# EAGLE board controller_old (EAGLE 9.0.0)
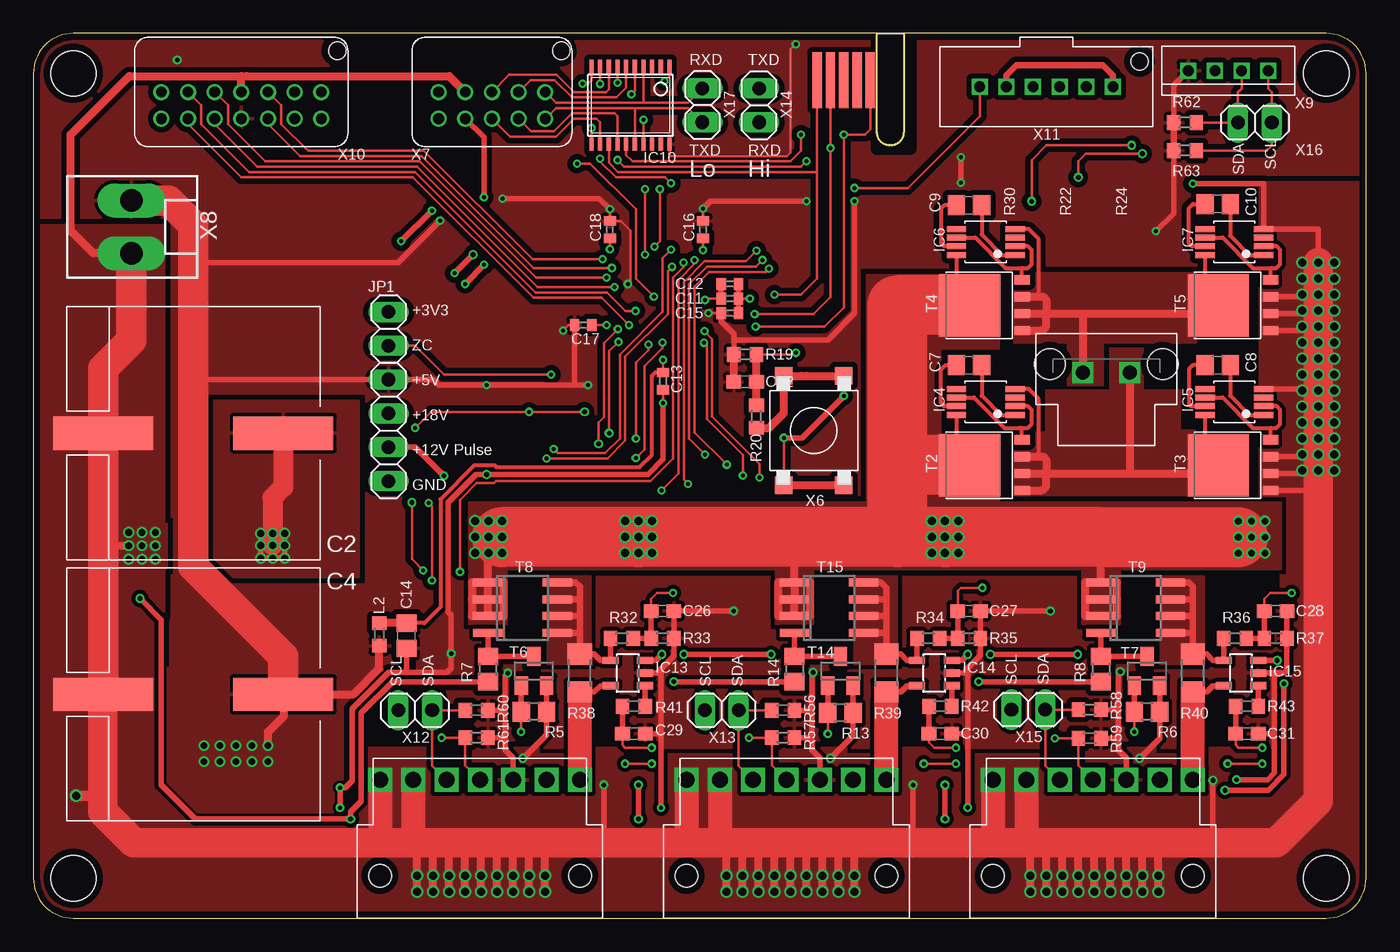
[diagram p6: board, top side]
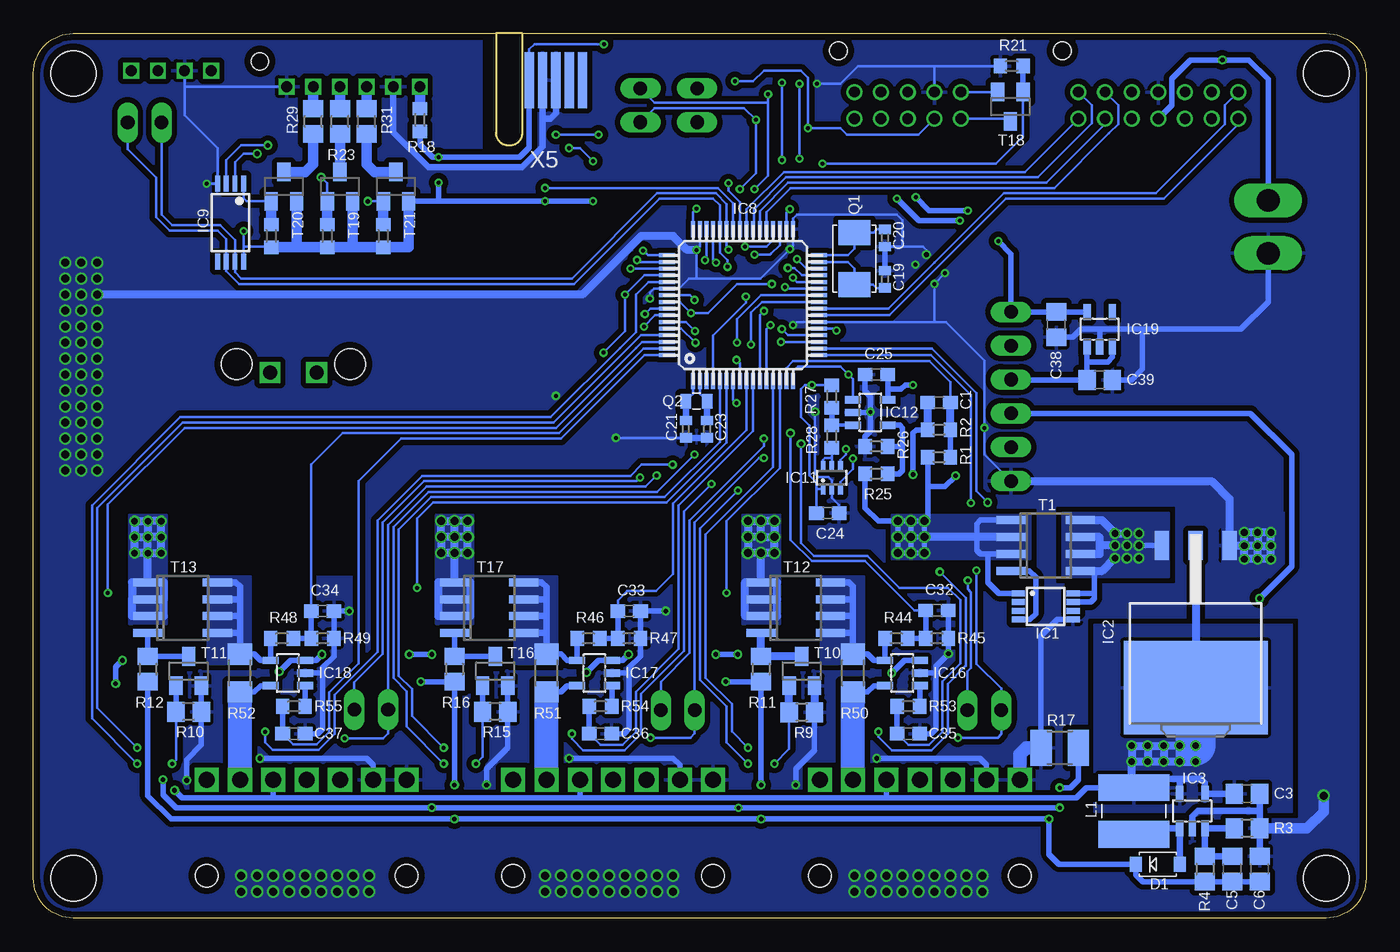
[diagram p7: board, bottom side, seen from below]

Size 100 x 66.4 mm. Coordinates in mm from the lower left corner, seen from the top.
Outline: 0,63.4 0,3 arc90 3,0 97,0 arc90 100,3 100,63.4 arc90 97,66.4 3,66.4 arc90 0,63.4
Copper layers (1*16): Top 0.035mm / dielectric 1.6mm / Bottom 0.035mm
Design rules "Elecrow_2-layer_PCB_eagle_rule *": minimum track width 6mil, minimum drill 0.3mm, track to track 0.2mm, track to pad 0.2mm, pad to pad 6mil, via to via 8mil, smd to smd 0mil, copper to edge 20mil, drill to drill 10mil, minimum pad ring 6mil, minimum via ring 6mil, stop-mask expansion 0mil, vias tented up to drill 100mil, thermal gap 10mil
Net classes: 0 µC: width 0.2 mm, drill 0.3 mm, clearance 0.2 mm; 1 +18V: width 0.4 mm, drill 0.35 mm, clearance 0.3 mm
Holes 3.4 mm at 3,63.4 97,63.4 97,3 3,3

## Footprints (pad centres in the part's own frame; a part is rotated, then mirrored left to right if it is on the bottom)
C0603 = smd 1.1 x 1: 1 -0.85,0; 2 0.85,0
C_EEVFK = smd 7.5 x 2.5: + -6.75,0; - 6.75,0
C0805 = smd 1.3 x 1.5: 1 -0.95,0; 2 0.95,0
C0402 = smd 0.7 x 0.9: 1 -0.65,0; 2 0.65,0
SOD-123 = smd 0.9 x 1.1: 1 -1.635,0; 2 1.635,0
MSOP8 = smd 0.45 x 1: 1 -0.975,-2.05; 2 -0.325,-2.05; 3 0.325,-2.05; 4 0.975,-2.05; 5 0.975,2.05; 6 0.325,2.05; 7 -0.325,2.05; 8 -0.975,2.05
TO263 = smd 1.07 x 2.16: 1 -2.54,-14.17; 2 0,-14.17; 3 2.54,-14.17 | smd 10.8 x 7: 4 0,-3.5
SOT23-5L = smd 0.55 x 1.2: 1 -0.95,-1.3; 2 0,-1.3; 3 0.95,-1.3; 4 0.95,1.3; 5 -0.95,1.3
VSSOP-8 = smd 0.45 x 1.45: 1 -0.975,-2.2; 2 -0.325,-2.2; 3 0.325,-2.2; 4 0.975,-2.2; 5 0.975,2.2; 6 0.325,2.2; 7 -0.325,2.2; 8 -0.975,2.2
TQFP64-10X10 = smd 1.2 x 0.3: 1 -5.7,3.75; 2 -5.7,3.25; 3 -5.7,2.75; 4 -5.7,2.25; 5 -5.7,1.75; 6 -5.7,1.25; 7 -5.7,0.75; 8 -5.7,0.25; 9 -5.7,-0.25; 10 -5.7,-0.75; 11 -5.7,-1.25; 12 -5.7,-1.75; 13 -5.7,-2.25; 14 -5.7,-2.75; 15 -5.7,-3.25; 16 -5.7,-3.75; 33 5.7,-3.75; 34 5.7,-3.25; 35 5.7,-2.75; 36 5.7,-2.25; 37 5.7,-1.75; 38 5.7,-1.25; 39 5.7,-0.75; 40 5.7,-0.25; 41 5.7,0.25; 42 5.7,0.75; 43 5.7,1.25; 44 5.7,1.75; 45 5.7,2.25; 46 5.7,2.75; 47 5.7,3.25; 48 5.7,3.75 | smd 0.3 x 1.2: 17 -3.75,-5.7; 18 -3.25,-5.7; 19 -2.75,-5.7; 20 -2.25,-5.7; 21 -1.75,-5.7; 22 -1.25,-5.7; 23 -0.75,-5.7; 24 -0.25,-5.7; 25 0.25,-5.7; 26 0.75,-5.7; 27 1.25,-5.7; 28 1.75,-5.7; 29 2.25,-5.7; 30 2.75,-5.7; 31 3.25,-5.7; 32 3.75,-5.7; 49 3.75,5.7; 50 3.25,5.7; 51 2.75,5.7; 52 2.25,5.7; 53 1.75,5.7; 54 1.25,5.7; 55 0.75,5.7; 56 0.25,5.7; 57 -0.25,5.7; 58 -0.75,5.7; 59 -1.25,5.7; 60 -1.75,5.7; 61 -2.25,5.7; 62 -2.75,5.7; 63 -3.25,5.7; 64 -3.75,5.7
TSSOP8 = smd 1.2 x 0.35: 1 -2.925,0.975; 2 -2.925,0.325; 3 -2.925,-0.325; 4 -2.925,-0.975; 5 2.925,-0.975; 6 2.925,-0.325; 7 2.925,0.325; 8 2.925,0.975
TSSOP20 = smd 0.305 x 0.991: 1 -2.925,-2.918; 2 -2.275,-2.918; 3 -1.625,-2.918; 4 -0.975,-2.918; 5 -0.325,-2.918; 6 0.325,-2.918; 7 0.975,-2.918; 8 1.625,-2.918; 9 2.275,-2.918; 10 2.925,-2.918; 11 2.925,2.918; 12 2.275,2.918; 13 1.625,2.918; 14 0.975,2.918; 15 0.325,2.918; 16 -0.325,2.918; 17 -0.975,2.918; 18 -1.625,2.918; 19 -2.275,2.918; 20 -2.925,2.918
SC70-6L = smd 0.35 x 0.8: 1 -0.65,-0.85; 2 0,-0.85; 3 0.65,-0.85; 4 0.65,0.85; 5 0,0.85; 6 -0.65,0.85
1X06 = drill 1.016 long: 1 -6.35,0; 2 -3.81,0; 3 -1.27,0; 4 1.27,0; 5 3.81,0; 6 6.35,0
WE-TPC = smd 5.3 x 2: 1 0,1.75; 2 0,-1.75
L0603 = smd 1 x 1.1: 1 -0.85,0; 2 0.85,0
5X3.2 = smd 1.9 x 2.4: 1 -1.95,0; 2 1.95,0
2X1.2 = smd 0.8 x 1.1: 1 -0.8,0; 2 0.8,0
R0603 = smd 1 x 1.1: 1 -0.85,0; 2 0.85,0
R0805 = smd 1.3 x 1.5: 1 -0.95,0; 2 0.95,0
R1210 = smd 1.6 x 2.7: 1 -1.4,0; 2 1.4,0
R1206 = smd 1.6 x 1.803: 1 -1.422,0; 2 1.422,0
SO8 = smd 0.6 x 2.2: 1 -1.905,-2.6; 2 -0.635,-2.6; 3 0.635,-2.6; 4 1.905,-2.6; 5 1.905,2.6; 6 0.635,2.6; 7 -0.635,2.6; 8 -1.905,2.6
LFPAK56-5 = smd 0.7 x 1.15: 1 -1.905,-2.725; 2 -0.635,-2.725; 3 0.635,-2.725; 4 1.905,-2.725 | smd 4.7 x 4.6: 5 0,1.2
SOT23 = smd 1 x 1.4: 1 -0.95,-1.1; 2 0.95,-1.1; 3 0,1.1
ULTRAFIT-2 = drill 1.05 square: 1 -1.75,0; 2 1.753,0 | hole 2.3: -4.25,-0.63; 4.25,-0.63
NANOFIT-7 = drill 1.2 square: 1 7.5,10.37; 2 5,10.37; 3 2.5,10.37; 4 0,10.37; 5 -2.5,10.37; 6 -5,10.37; 7 -7.5,10.37 | hole 1.7: -7.5,3.2; 7.5,3.2
DEBUG-CON = smd 0.7 x 4.2: 1 -2,-3.5; 2 -1,-3.5; 3 0,-3.5; 4 1,-3.5; 5 2,-3.5 | smd 0.7 x 4.2 bottom: 6 -2,-3.5; 7 -1,-3.5; 8 0,-3.5; 9 1,-3.5; 10 2,-3.5
B3S = smd 1.3 x 1.3: 1 4.1,-2.25; 2 -4.1,-2.25; 3 4.1,2.25; 4 -4.1,2.25
I-GRID-10 = drill 0.8: 1 -4,2; 2 -4,0; 3 -2,2; 4 -2,0; 5 0,2; 6 0,0; 7 2,2; 8 2,0; 9 4,2; 10 4,0 | hole 1.3: -5.2,-3.1
KK-156-2 = drill 1.7 pad 2.184 long: 1 -1.98,0; 2 1.98,0
MICRO-LATCH-4 = drill 0.8 square: 1 -3,0; 2 -1,0; 3 1,0; 4 3,0
I-GRID-14 = drill 0.8: 1 -6,2; 2 -6,0; 3 -4,2; 4 -4,0; 5 -2,2; 6 -2,0; 7 0,2; 8 0,0; 9 2,2; 10 2,0; 11 4,2; 12 4,0; 13 6,2; 14 6,0 | hole 1.3: -7.2,-3.1
MICRO-CLASP-6 = drill 0.8 square: 1 -5,0; 2 -3,0; 3 -1,0; 4 1,0; 5 3,0; 6 5,0 | hole 1.3: 7,1.9
1X02 = drill 1.016 long: 1 -1.27,0; 2 1.27,0

## Placement (x,y rotation side)
C1  1nF  [C0603]  32.05,38.7 180 bottom
C2  3300µ  [C_EEVFK]  12,36.4 180 top
C3  2.2µF  [C0805]  8.95,9.35 0 bottom
C4  3300µ  [C_EEVFK]  12,16.8 180 top
C5  150pF  [C0805]  10.05,3.7 90 bottom
C6  4.7µF  [C0805]  8,3.7 90 bottom
C7  680nF 5%  [C0805]  70.2,41.5 0 top
C8  680nF 5%  [C0805]  88.85,41.5 0 top
C9  680nF 5%  [C0805]  70.2,53.5 0 top
C10  680nF 5%  [C0805]  88.85,53.6 0 top
C11  1µF  [C0402]  52.25,46.5 0 top
C12  100nF  [C0402]  52.25,47.6 0 top
C13  100nF  [C0402]  47.25,40.3 270 top
C14  10µF  [C0805]  28,21.2 270 top
C15  100nF  [C0402]  52.25,45.4 0 top
C16  100nF  [C0402]  50.25,51.67 270 top
C17  100nF  [C0402]  41.25,44.5 0 top
C18  100nF  [C0402]  43.25,51.67 270 top
C19  27pF  [C0402]  36.1,47.95 90 bottom
C20  27pF  [C0402]  36.1,51.05 270 bottom
C21  22pF  [C0402]  51.05,36.7 270 bottom
C22  100pF  [C0603]  53.4,40.25 0 top
C23  22pF  [C0402]  49.45,36.7 270 bottom
C24  100nF  [C0603]  40.4,30.4 0 bottom
C25  100nF  [C0603]  36.75,40.8 180 bottom
C26  1nF  [C0603]  47.2,23.05 0 top
C27  1nF  [C0603]  70.2,23.05 0 top
C28  1nF  [C0603]  93.2,23.05 0 top
C29  150nF  [C0603]  45.05,13.85 0 top
C30  150nF  [C0603]  68.05,13.85 0 top
C31  150nF  [C0603]  91.05,13.85 0 top
C32  1nF  [C0603]  32.2,23.1 0 bottom
C33  1nF  [C0603]  55.3,23.05 0 bottom
C34  1nF  [C0603]  78.3,23.05 0 bottom
C35  150nF  [C0603]  34.35,13.85 0 bottom
C36  150nF  [C0603]  57.45,13.85 0 bottom
C37  150nF  [C0603]  80.45,13.85 0 bottom
C38  10µF  [C0805]  23.25,44.55 270 bottom
C39  10µF  [C0805]  20,40.4 0 bottom
D1  MBR05020L  [SOD-123]  15.63,4.05 0 bottom
IC1  LTC4357  [MSOP8]  24.05,23.4 270 bottom
IC2  LM1084  [TO263]  12.8,13.79 180 bottom
IC3  LMR62014  [SOT23-5L]  13.05,8.05 0 bottom
IC4  LM74670  [VSSOP-8]  71.45,38.75 90 top
IC5  LM74670  [VSSOP-8]  90.1,38.75 90 top
IC6  LM74670  [VSSOP-8]  71.45,50.75 90 top
IC7  LM74670  [VSSOP-8]  90.1,50.75 90 top
IC8  ATSAMC21J  [TQFP64-10X10]  46.75,46 90 bottom
IC9  PCA9533  [TSSOP8]  85.2,52.2 270 bottom
IC10  ST2378E  [TSSOP20]  44.8,61 180 top
IC11  5k  [SC70-6L]  40.1,33.05 0 bottom
IC12  LT1803  [SOT23-5L]  37.2,37.95 270 bottom
IC13  INA196  [SOT23-5L]  44.6,18.4 90 top
IC14  INA196  [SOT23-5L]  67.6,18.4 90 top
IC15  INA196  [SOT23-5L]  90.6,18.4 90 top
IC16  INA196  [SOT23-5L]  34.8,18.4 90 bottom
IC17  INA196  [SOT23-5L]  57.9,18.4 90 bottom
IC18  INA196  [SOT23-5L]  80.9,18.4 90 bottom
IC19  [SOT23-5L]  20,44.2 0 bottom
JP1  [1X06]  26.65,39.15 90 top
L1  10µH  [WE-TPC]  17.43,8.05 180 bottom
L2  50R @ 20MHz  [L0603]  25.95,21.3 90 top
Q1  24MHz  [5X3.2]  38.4,49.5 90 bottom
Q2  32768kHz  [2X1.2]  50.25,38.8 0 bottom
R1  665k  [R0603]  32.05,34.6 180 bottom
R2  210k  [R0603]  32.05,36.65 0 bottom
R3  13k3  [R0805]  8.95,6.75 180 bottom
R4  182k  [R0805]  12.1,3.7 270 bottom
R5  4,7k  [R0805]  37.55,15.5 180 top
R6  4,7k  [R0805]  83.55,15.5 180 top
R7  4,7k  [R0805]  34.1,18.7 270 top
R8  4,7k  [R0805]  80.1,18.7 270 top
R9  4,7k  [R0805]  42.35,15.45 180 bottom
R10  4,7k  [R0805]  88.35,15.5 180 bottom
R11  4,7k  [R0805]  45.4,18.7 270 bottom
R12  4,7k  [R0805]  91.4,18.7 270 bottom
R13  4,7k  [R0805]  60.55,15.4 180 top
R14  4,7k  [R0805]  57.1,18.7 270 top
R15  4,7k  [R0805]  65.35,15.5 180 bottom
R16  4,7k  [R0805]  68.4,18.7 270 bottom
R17  0  [R1210]  23,12.8 0 bottom
R18  10k  [R0603]  71,59.9 270 bottom
R19  2k2  [R0603]  53.4,42.3 180 top
R20  330  [R0603]  54.25,37.65 90 top
R21  10k  [R0603]  26.6,63.95 0 bottom
R22  10k  [R0603]  77.95,51.2 270 bottom
R23  294  [R0805]  77,59.8 90 bottom
R24  10k  [R0603]  82.15,51.2 270 bottom
R25  100k 0.1%  [R0603]  36.75,33.35 180 bottom
R26  41k7 0.1%  [R0603]  36.75,35.4 0 bottom
R27  24k 0.1%  [R0603]  40.1,39.15 90 bottom
R28  200 0.1%  [R0603]  40.1,36.15 90 bottom
R29  210  [R0805]  79,59.8 90 bottom
R30  10k  [R0603]  73.75,51.2 270 bottom
R31  210  [R0805]  75,59.8 90 bottom
R32  665k  [R0603]  44.15,21 180 top
R33  210k  [R0603]  47.2,21 180 top
R34  665k  [R0603]  67.15,21 180 top
R35  210k  [R0603]  70.2,21 180 top
R36  665k  [R0603]  90.15,21 180 top
R37  210k  [R0603]  93.2,21 180 top
R38  20m  [R1206]  41,18.4 270 top
R39  20m  [R1206]  64,18.4 270 top
R40  20m  [R1206]  87,18.4 270 top
R41  1k1  [R0603]  45.05,15.9 180 top
R42  1k1  [R0603]  68.05,15.9 180 top
R43  1k1  [R0603]  91.05,15.9 180 top
R44  665k  [R0603]  35.25,21 180 bottom
R45  210k  [R0603]  32.2,21 180 bottom
R46  665k  [R0603]  58.35,21 180 bottom
R47  210k  [R0603]  55.3,21 180 bottom
R48  665k  [R0603]  81.35,21 180 bottom
R49  210k  [R0603]  78.3,21 180 bottom
R50  20m  [R1206]  38.5,18.4 270 bottom
R51  20m  [R1206]  61.5,18.4 270 bottom
R52  20m  [R1206]  84.5,18.4 270 bottom
R53  1k1  [R0603]  34.35,15.9 180 bottom
R54  1k1  [R0603]  57.45,15.9 180 bottom
R55  1k1  [R0603]  80.45,15.9 180 bottom
R56  4.7k  [R0603]  56.25,15.6 0 top
R57  4.7k  [R0603]  56.25,13.55 0 top
R58  4.7k  [R0603]  79.25,15.65 0 top
R59  4.7k  [R0603]  79.25,13.5 0 top
R60  4.7k  [R0603]  33.25,15.6 0 top
R61  4.7k  [R0603]  33.25,13.55 0 top
R62  4.7k  [R0603]  86.4,59.7 180 top
R63  4.7k  [R0603]  86.4,57.6 180 top
T1  FDS6670A  [SO8]  24.05,27.96 270 bottom
T2  PSMN1R0  [LFPAK56-5]  71.45,34 90 top
T3  PSMN1R0  [LFPAK56-5]  90.1,34 90 top
T4  PSMN1R0  [LFPAK56-5]  71.45,46 90 top
T5  PSMN1R0  [LFPAK56-5]  90.1,46 90 top
T6  NVR4003NT3G  [SOT23]  37.55,18.55 0 top
T7  NVR4003NT3G  [SOT23]  83.55,18.55 0 top
T8  IRF9392PBF  [SO8]  36.7,23.3 270 top
T9  IRF9392PBF  [SO8]  82.7,23.3 270 top
T10  NVR4003NT3G  [SOT23]  42.35,18.55 0 bottom
T11  NVR4003NT3G  [SOT23]  88.35,18.55 0 bottom
T12  IRF9392PBF  [SO8]  42.8,23.3 270 bottom
T13  IRF9392PBF  [SO8]  88.8,23.3 270 bottom
T14  NVR4003NT3G  [SOT23]  60.55,18.55 0 top
T15  IRF9392PBF  [SO8]  59.7,23.3 270 top
T16  NVR4003NT3G  [SOT23]  65.35,18.55 0 bottom
T17  IRF9392PBF  [SO8]  65.8,23.3 270 bottom
T18  BSS7728NH6327XTSA1  [SOT23]  26.7,60.9 180 bottom
T19  BSS84PH6433XTMA1  [SOT23]  77,54.9 0 bottom
T20  BSS84PH6433XTMA1  [SOT23]  81.2,54.9 0 bottom
T21  BSS84PH6433XTMA1  [SOT23]  72.8,54.9 0 bottom
X1  ULTRAFIT-20  [ULTRAFIT-2]  80.5,40.95 180 top
X2  NANOFIT-7  [NANOFIT-7]  33.5,0 0 top
X3  NANOFIT-7  [NANOFIT-7]  56.5,0 0 top
X4  NANOFIT-7  [NANOFIT-7]  79.5,0 0 top
X5  JTAG-EDGE-CON  [DEBUG-CON]  60.8,66.4 0 bottom
X6  B3S-1000  [B3S]  58.55,36.6 270 top
X7  IGRID-10  [I-GRID-10]  34.4,62 180 top
X8  [KK-156-2]  7.35,51.88 270 top
X9  MICRO-LATCH-4  [MICRO-LATCH-4]  89.65,63.6 0 top
X10  IGRID-14  [I-GRID-14]  15.6,62 180 top
X11  MICRO-CLASP-6  [MICRO-CLASP-6]  76,62.4 0 top
X12  [1X02]  28.65,15.6 180 top
X13  [1X02]  51.65,15.6 180 top
X14  [1X02]  54.45,61 90 top
X15  [1X02]  74.65,15.65 180 top
X16  [1X02]  91.65,59.7 0 top
X17  [1X02]  50.2,61 270 top

## Tracks (layer width: path | path; a pad name or v marks a point on that pad's centre or on a via)
12V_WAVE
  Bottom 0.2: C1.1 31.2,40.23 32.77,41.8 43,41.8 43.5,41.3 IC8.15
  Bottom 0.4: R1.1 R2.2
  Bottom 0.6: R2.2 C1.1
+3V3  (via drill 0.3)
  Top 0.2: IC10.11 v41.88,59.3 | IC10.1 47.73,63.17 v47.35,62.8
  Top 0.4: v33.8,54.1 33.8,58.6 X7.7 | v29.9,53.1 v27.6,50.8
  Bottom 0.2: X7.7 33.6,58.8 38.95,58.8 39.45,59.3 v41.88,59.3 41.88,63.08 42.4,63.6 45.2,63.6 46,62.8 v47.35,62.8
  Bottom 0.4: v27.6,50.8 26.65,49.85 JP1.6 C38.1 IC19.5 | v33.8,54.1 32.8,53.1 30.79,53.1 30.21,53.1 v29.9,53.1
+5V  (via drill 0.3, 0.35, 0.5)
  Top 0.2: v50.65,45.4 C15.1 | C16.1 v50.25,53.25 | v43.25,53.2 C18.1 44.08,52.33 44.8,51.6 44.8,47.8 v44.6,47.6 | IC10.20 47.73,57.27 47.8,57.2 56.55,57.2 56.8,57.45 56.8,65.19 v57.2,65.59 | v39.75,44.1 40.15,44.5 C17.1
  Top 0.4: IC13.3 46.7,19.35 v47.15,19.8 | IC14.3 69.65,19.35 v70.1,19.8 | IC15.3 v93.32,19.35 | X2.3 36,12.05 35.4,12.65 35.4,13.55 | X4.3 82,12.05 81.4,12.65 81.4,13.5 | X3.3 59,12.05 58.4,12.65 58.4,13.55 | v89.4,9.6 92.65,9.6 93.83,10.78 v93.83,17.6 | 35.4,13.55 35.4,15.6 | R60.2 35.4,15.6 | R61.2 35.4,13.55 | 35.4,15.6 35.4,18.2 v35.6,18.4 | v71.8,19.8 v78.35,19.8 | 12,40.4 12,40.42 JP1.4 30.02,40.42 30.42,40.02 v34.02,40.02 41.58,40.02 v41.6,40 | v69.6,55.2 v69.6,57.1 | R62.2 85.55,62.5 X9.1 | v84.22,51.55 85.55,52.88 R63.2 | 57.15,13.6 R57.2 58.4,13.55 | v48.8,19.8 v55.35,19.8 | v81.55,18.5 81.4,18.35 81.4,15.65 | 81.4,13.5 81.4,15.65 | v58.5,18.45 58.4,18.35 58.4,15.6 | 58.4,13.55 58.4,15.6 | R56.2 58.4,15.6 | R58.2 81.4,15.65 | R59.2 81.4,13.5 | v43.25,53.2 42.45,54 v35.2,54 | v30.5,52.35 27.35,49.2 12,49.2 | v58,53.8 50.8,53.8 v50.25,53.25 | R19.2 52.55,43.4 | C15.1 51.6,44.8 52.55,43.85 52.55,43.4 | 52.55,43.4 59.6,43.4 61.6,45.4 v61.6,53.8 | C17.1 40.6,40.02 39.65,40.02
  Top 0.5: R63.2 R62.2
  Top 0.6: v17.6,12.95 17.6,14 18.8,15.2 18.8,16.75 C4.+ 24.02,16.8 25.95,18.73 L2.1 | C22.1 R19.2
  Top 2.3: C4.+ 18.75,19.65 12,26.4 12,40.4 12,49.2 12,52 10.14,53.86 X8.1
  Bottom 0.2: 41.25,32.2 C24.1 | IC11.1 41.2,32.2 41.25,32.2 | R27.2 v41.6,40 42.1,40 42.4,39.7 42.4,37.6 41.77,36.97 41.77,33.21 41.25,32.68 41.25,32.2 | IC8.56 51.5,46.25 v50.65,45.4 49.4,45.4 47.2,47.6 v44.6,47.6 | v50.25,53.25 50.5,53 IC8.48 | IC8.34 43.5,52.95 v43.25,53.2 | R24.2 82.2,50.4 84.22,50.4 | IC9.8 84.22,50.4 | 84.22,50.4 v84.22,51.55 | v57.2,65.59 62.41,65.59 62.8,65.2 X5.1 | IC8.21 39.9,44.25 v39.75,44.1
  Bottom 0.4: IC12.5 35.9,39.7 | 35.9,39.7 C25.1 | 36,9.05 X2.3 | 36,9.05 59,9.05 | 59,9.05 82,9.05 | X4.3 82,9.05 | v55.35,19.8 55.8,19.35 IC17.3 57.6,19.35 v58.5,18.45 | v78.35,19.8 78.8,19.35 IC18.3 80.7,19.35 v81.55,18.5 | v89.4,9.6 88.85,9.05 82,9.05 | v93.83,17.6 93.83,18.84 v93.32,19.35 | 36,9.05 21.75,9.05 21,9.8 L1.2 | X3.3 59,9.05 | v35.6,18.4 34.65,19.35 IC16.3 | v47.15,19.8 v48.8,19.8 | v70.1,19.8 v71.8,19.8 | v34.02,40.02 34.58,40.02 34.9,39.7 35.9,39.7 | X5.1 62.8,57.81 63.51,57.1 v69.6,57.1 70.05,57.1 71,58.05 R18.2 | X8.1 7.35,60 7.35,62.95 8.8,64.4 v10.8,64.4 13.2,64.4 14.6,63 14.6,61 X10.7 | v30.5,52.35 33.55,52.35 v35.2,54 | T21.2 69.6,53.8 | 69.6,53.8 v61.6,53.8 v58,53.8 | v69.6,55.2 69.6,53.8 | JP1.4 26.63,40.4 C39.1 20.95,41.75 | 20.95,41.75 20.95,42 IC19.1 | IC19.3 19.05,42.1 19.4,41.75 20.95,41.75
  Bottom 0.5: C3.1 IC3.4 12.1,10.15 12.4,10.45 14,10.45 | IC3.5 14,10.45 | 14,10.45 17.6,10.45 17.6,9.8
  Bottom 0.6: IC2.2 IC2.4 | 17.6,9.8 L1.2 17.6,9.96 v17.6,11.74 | v17.6,12.95 17.6,12.9 | 17.6,12.9 v17.6,11.74 | v16.4,12.95 16.45,12.9 17.6,12.9 | v16.4,11.74 v17.6,11.74 | v15.2,11.74 v16.4,11.74 | v16.4,12.95 v15.2,12.95 | v14,12.95 v15.2,12.95 | v14,11.74 v15.2,11.74 | v14,11.74 v14,12.95 | v14,12.95 v12.8,12.95 v12.8,11.74 v14,11.74 | v16.4,12.95 v16.4,11.74 | v15.2,12.95 v15.2,11.74
  Bottom 0.8: 76.05,50.35 T19.2 | 76.05,50.35 R22.2 80.25,50.35 | R24.2 80.25,50.35 | T20.2 80.25,50.35 | 76.05,50.35 R30.2 71.85,50.35 T21.2
  Bottom 3: v12.8,12.95 IC2.4
  pour Bottom (isolate 0.305): 5.6,22 20.4,22 20.4,8 5.6,8
  pour Top: 9.6,18.8 23.2,18.8 23.2,7.6 12.4,7.6 9.6,10.4
  pour Top (isolate 0.4, rank 4): 0,0 100,0 100,66.4 0,66.4
+12V_PULSE  (via drill 0.35, 0.5, 0.6)
  Top 0.3: IC6.8 69.25,47 T4.5 | IC4.8 69.25,35 T2.5
  Top 0.4: v30.8,33.2 28.66,35.34 JP1.2
  Top 0.6: T15.3 58.3,22.66 58.3,23.93 | 58.3,23.93 T15.2 | 58.3,23.93 58.3,25.2 57.2,25.2 | T15.1 55.9,25.2 55.9,23.93 | T15.2 55.9,23.93 | T15.3 55.9,22.66 55.9,23.93 | T9.1 81.3,25.2 81.3,23.93 | 81.3,23.93 T9.2 78.9,23.93 | 81.3,23.93 81.3,22.66 T9.3 78.9,22.66 78.9,23.93 | T9.1 78.9,25.2 78.9,23.93 | T8.1 35.3,25.2 35.3,23.93 | T8.1 32.9,25.2 32.9,23.93 | 32.9,23.93 T8.2 | 32.9,23.93 32.9,22.66 T8.3 | T8.2 35.3,23.93 | T8.3 35.3,22.66 35.3,23.93 | T8.2 T8.1 | T8.3 T8.2 | T9.1 80.1,28.6 | v34.15,28.6 34.1,28.6 T8.1 | T15.1 57.1,28.6 | T15.1 T15.2 | T15.3 T15.2
  Top 4.5: 64.8,28.6 v68.4,28.6 80.1,28.6 v90.4,28.6 | 64.8,28.6 57.1,28.6 v45.4,28.6 v35.15,28.6 | T2.5 64.8,34 | 64.8,34 64.8,28.6 | T4.5 64.8,46 64.8,34
  Bottom 0.4: T1.3 28.4,27.33 | 28.4,27.33 28.93,27.33 29.2,27.6 29.2,28.6 29.2,29.6 28.93,29.87 T1.1 | 28.4,27.33 28.4,25.2 27.57,24.38 IC1.1 | v33.15,29.8 32.9,30.05 32.9,32.4 | 32.9,32.4 R1.2 | v33.15,29.8 v34.15,29.8 | v34.15,29.8 v35.15,29.8 | 33.2,28.6 v33.15,28.6 v33.15,29.8 | 33.2,28.6 v34.15,28.6 | v34.15,28.6 v35.15,28.6 | 33.2,28.6 33.15,28.55 v33.15,27.4 v34.15,27.4 | v35.15,28.6 v35.15,27.4 v34.15,27.4 | v35.15,28.6 v35.15,29.8 | v34.15,28.6 v34.15,29.8 | v34.15,27.4 34.15,28.35 | 32.9,32.4 31.6,32.4 v30.8,33.2 | R25.2 37.6,30.8 36.6,29.8 v35.15,29.8
  Bottom 0.6: T17.1 69.6,25.2 69.6,23.93 | 69.6,23.93 T17.2 67.2,23.93 | 69.6,23.93 69.6,22.66 T17.3 67.2,22.66 67.2,23.93 | T17.1 67.2,25.2 67.2,23.93 | 92.6,23.93 92.6,22.66 T13.3 90.2,22.66 90.2,23.93 | 92.6,23.93 T13.2 90.2,23.93 | 92.6,23.93 92.6,25.2 T13.1 | 90.2,23.93 90.2,25.2 T13.1 | 46.6,22.66 46.6,23.93 | 46.6,23.93 T12.2 44.2,23.93 | 46.6,23.93 46.6,25.2 T12.1 | T12.3 44.2,22.66 44.2,23.93 | 44.2,23.93 44.2,25.2 T12.1 | T13.1 v91.4,27.4 | T17.1 v68.4,27.4 | v68.4,27.4 v67.4,27.4 67.4,28.5 67.3,28.6 v67.4,28.6 | v68.4,27.4 v69.4,27.4 v69.4,28.6 | v68.4,28.6 v69.4,28.6 | v67.4,28.6 v68.4,28.6 | v67.4,28.6 v67.4,29.8 v68.4,29.8 | v68.4,28.6 v68.4,29.8 | v68.4,27.4 v68.4,28.6 | v68.4,29.8 v69.4,29.8 v69.4,28.6 | v91.4,29.8 v90.4,29.8 v90.4,28.6 | v91.4,29.8 v92.4,29.8 92.4,28.7 92.3,28.6 | 92.3,28.6 v92.4,28.6 v92.4,27.4 v91.4,27.4 | 92.3,28.6 91.5,28.6 | 91.5,28.6 v91.4,28.6 | v90.4,28.6 v91.4,28.6 | v91.4,27.4 v90.4,27.4 v90.4,28.6 | v91.4,27.4 91.4,28.5 91.5,28.6 | v91.4,29.8 v91.4,28.6 | T12.1 v45.4,27.4 | v45.4,27.4 v46.4,27.4 v46.4,28.6 | v46.4,28.6 v46.4,29.8 v45.4,29.8 | v45.4,28.6 v46.4,28.6 | v45.4,28.6 v45.4,29.8 | v45.4,28.6 v44.4,28.6 | v44.4,28.6 v44.4,29.8 v45.4,29.8 | v45.4,27.4 v44.4,27.4 v44.4,28.6 | T1.2 29.2,28.6 v33.15,28.6
  pour Bottom (isolate 0.305, no thermals): 90,22.1 92.8,22.1 92.8,30.25 90,30.25
  pour Bottom (isolate 0.305, no thermals): 67,22.1 69.8,22.1 69.8,30.25 67,30.25
  pour Bottom (isolate 0.305, no thermals): 44,22.1 46.8,22.1 46.8,30.25 44,30.25
  pour Bottom (isolate 0.305, no thermals): 25.2,30.25 35.6,30.25 35.6,26.95 25.2,26.95
  pour Top (isolate 0.305, no thermals): 32.7,31.2 62.55,31.2 62.55,48.25 72.45,48.25 72.45,42.75 68.05,42.75 68.05,36.25 72.45,36.25 72.45,31.2 93.6,31.2 93.6,26.2 81.5,26.2 81.5,22.1 78.7,22.1 78.7,26.2 58.5,26.2 58.5,22.1 55.7,22.1 55.7,26.2 35.5,26.2 35.5,22.1 32.7,22.1
+18V  (via drill 0.35)
  Top 0.4: v48.05,17.75 R14.2 | v45.4,10 v45.4,7.45 | v68.4,7.45 v68.4,10 | R7.2 26.95,17.75 24.6,15.4 24.6,8.77 23.8,7.96 v23.8,7.45 12.15,7.45 9.6,10 9.6,22.4 v8,24 | v70.93,17.75 R8.2
  Bottom 0.4: C6.1 C5.1 R4.2 16.75,2.75 17.27,3.27 D1.1 23.05,4.05 23.8,4.8 v23.8,7.45 v45.4,7.45 v68.4,7.45 89.64,7.45 91.4,9.2 R12.2 | v48.05,17.75 R11.2 v45.4,10 | v68.4,10 R16.2 v70.93,17.75 | v8,24 5.6,26.4 5.6,34.8 8.68,37.88 JP1.3
AC_IN_+
  Top 0.3: IC5.8 87.9,33.37 | IC4.4 74.67,39.73 75.41,38.99 75.41,34.64 75.4,34.63
  Top 0.6: T2.2 76,33.37 | 76,33.37 82.25,33.37 | 82.25,33.37 87.9,33.37 88.9,33.37 T3.5 | T2.3 75.4,34.63 75.77,34.63 76,34.4 76,33.37 | T2.1 75.69,32.09 76,32.4 76,33.37 | X1.1 82.25,33.37
  pour Top (isolate 0.406, no thermals): 73.45,31.75 87.1,31.75 87.1,36.6 86,36.6 86,39.6 83.25,39.6 83.25,42.75 80.8,42.75 80.8,39.6 76,39.6 76,36.45 73.45,36.45
AC_IN_-
  Top 0.3: IC7.8 87.9,45.37 | IC6.4 74.67,51.73 75.41,50.99 75.41,46.64 75.4,46.63
  Top 0.6: T4.2 76,45.37 | 76,45.37 78.75,45.37 | 78.75,45.37 X1.2 | 78.75,45.37 87.9,45.37 88.9,45.37 T5.5 | T4.3 75.4,46.63 75.77,46.63 76,46.4 76,45.37 | T4.1 75.69,44.09 76,44.4 76,45.37
  pour Top (isolate 0.406, no thermals): 73.6,48.4 87.2,48.4 87.2,43.2 80.25,43.2 80.25,40 77.6,40 77.6,43.2 73.6,43.2
AGND  (via drill 0.3, 0.35)
  Top 0.2: v47.25,38.65 C13.2
  Top 0.4: C28.2 R37.1 94.05,18.6 93.85,18.4 93.1,18.4 | 47.1,18.4 47.1,18.72 48.05,19.67 R33.1 C26.2 48.8,23.05 v52.55,23.05 | IC13.2 47.1,18.4 | 70.1,18.4 70.1,18.77 71.05,19.72 R35.1 C27.2 v76.3,23.05 | IC14.2 70.1,18.4 | IC15.2 93.1,18.4 | 93.1,13.85 93.1,10.9 92.6,10.4 v90.27,10.4 | 93.1,13.85 93.1,18.4 | C31.2 93.1,13.85 | 70.1,18.4 70.1,13.85 | 70.1,13.85 v70.1,8.3 | v47.1,8.3 47.1,13.85 | 47.1,13.85 47.1,18.4 | C29.2 47.1,13.85 | 28,18.45 26.66,18.45 23.9,15.69 23.9,10.3 23.4,9.8 v23,9.8 v23,8.3 | C30.2 70.1,13.85 | C14.2 28,18.45 | 28,18.45 31.05,18.45 31.35,18.75 v31.35,19.85 31.35,22.75 31.1,23 31.1,31.2 33.2,33.3 v34,33.3 46.1,33.3 47.25,34.45 v47.25,38.65
  Bottom 0.2: IC8.7 47.5,38.9 v47.25,38.65
  Bottom 0.4: C32.2 R45.1 v31.35,19.85 32.3,18.9 32.3,18.4 | C36.2 55.65,13.85 55.3,14.2 55.3,18.4 | C37.2 78.65,13.85 78.3,14.2 78.3,18.4 | 32.3,18.4 32.3,14.2 32.65,13.85 C35.2 | 78.3,18.4 78.3,18.81 77.45,19.66 R49.1 C34.2 v76.3,23.05 | IC18.2 78.3,18.4 | 55.3,18.4 55.3,18.81 54.45,19.66 R47.1 C33.2 v52.55,23.05 | IC17.2 55.3,18.4 | IC16.2 32.3,18.4 | v23,8.3 38.45,8.3 v47.1,8.3 v70.1,8.3 89.3,8.3 90.27,9.27 v90.27,10.4 | v23,9.8 22.2,9.8 21.6,10.4 R17.2 | R2.1 33.75,36.65 34,36.4 v34,33.3
  Bottom 0.6: R2.1 C1.2
  pour Bottom (isolate 0.305, rank 2): 28.8,25.6 93.6,25.6 93.6,21.2 93.6,12.8 28.8,12.8
  pour Top (isolate 0.305, rank 2): 28.8,25.6 93.6,25.6 93.6,24.8 93.6,12.8 28.8,12.8
BOOST_FB
  Bottom 0.5: C5.2 R4.1 IC3.3 R3.2
BOOST_SW
  Bottom 0.5: D1.2 14,5.6 IC3.1 17.43,6.75 L1.1
CON0_HEATER_0
  Top 0.4: IC13.5 42.55,17.45 42.08,16.98 R38.2
  Top 1: 41,16.4 R38.2
  Top 1.8: X2.1 41,16.4
CON0_HEATER_0_CUR  (via drill 0.3)
  Top 0.2: v46.4,12.8 44.4,12.8 44.2,13 C29.1
  Top 0.4: C29.1 R41.2
  Bottom 0.2: v46.4,12.8 47.6,14 47.6,16.07 49.58,18.05 49.58,28.79 44.5,33.87 IC8.13
CON0_HEATER_0_IN
  Top 0.4: R38.1 42.08,19.82 42.55,19.35 IC13.4 R32.2
  Top 0.5: R38.1 41,21.39 | 41,21.39 T8.5 | 41,21.39 41,22.66 | 41,22.66 T8.6 | 41,22.66 41,23.93 | 41,23.93 T8.7 | T8.8 40.7,25.2 41,24.9 41,23.93
  pour Top (isolate 0.305, no thermals): 38.6,25.65 41.8,25.65 41.8,19.1 38.6,19.1
CON0_HEATER_0_VOL  (via drill 0.3)
  Top 0.2: C26.1 46.35,23.95 46.8,24.4 v48,24.4
  Top 0.4: R32.1 R33.2 C26.1
  Bottom 0.2: v48,24.4 48,29.8 44,33.8 IC8.14
CON0_HEATER_1
  Bottom 0.4: IC16.5 36.8,17.45 36.95,17.45 37.42,16.98 R50.2
  Bottom 1: 38.5,16.3 R50.2
  Bottom 1.8: X2.2 38.5,16.3
CON0_HEATER_1_CUR  (via drill 0.3, 0.35)
  Top 0.2: v42.4,35.6 42.4,37.2 42.8,37.6 42.8,43.15 v43.85,44.2
  Bottom 0.2: C35.1 34.35,13 32.79,13 31.8,13.99 31.8,17.77 30.45,19.12 30.45,23.88 31.37,24.8 35.03,24.8 37.43,27.2 41.43,27.2 42.4,28.17 v42.4,35.6 | v43.85,44.2 43.4,43.75 IC8.20
  Bottom 0.4: R53.2 C35.1
CON0_HEATER_1_IN
  Bottom 0.4: R50.1 37.42,19.82 36.95,19.35 IC16.4 R44.2
  Bottom 0.5: T12.8 38.8,25.2 38.5,24.9 38.5,23.93 | R50.1 38.5,21.39 | 38.5,21.39 T12.5 | 38.5,21.39 38.5,22.66 | 38.5,22.66 T12.6 | 38.5,22.66 38.5,23.93 | 38.5,23.93 T12.7
  pour Bottom (isolate 0.305, no thermals): 40.9,25.65 40.9,19.1 37.7,19.1 37.7,25.65
CON0_HEATER_1_VOL  (via drill 0.3, 0.35)
  Top 0.2: v43.2,36.4 43.2,42.55 v43.9,43.25
  Bottom 0.2: C32.1 33.9,23.1 37.6,26.8 41.6,26.8 43.2,28.4 v43.2,36.4 | v43.9,43.25 IC8.19
  Bottom 0.4: R44.1 R45.2 C32.1
CON0_SCL  (via drill 0.3, 0.35)
  Top 0.2: v30.65,13.55 R61.1 32.4,11.47 X2.4 | v29.25,26.1 28.4,26.95 v28.4,31.2
  Bottom 0.2: v30.65,13.55 27.65,13.55 27.38,13.82 X12.2 27.38,17.23 29.25,19.1 v29.25,26.1 | IC8.18 32.58,42.75 29.25,39.42 29.25,32.05 v28.4,31.2
CON0_SDA  (via drill 0.3)
  Top 0.2: X2.5 29.92,11.45 X12.1 R60.1 | v29.9,25.35 29.9,30.9 v29.65,31.15
  Bottom 0.2: 29.65,19.18 29.65,19.2 | X12.1 29.92,18.51 29.65,18.78 29.65,19.2 | 29.65,19.2 29.65,24.44 29.9,24.69 v29.9,25.35 | IC8.17 38.8,42.25 32.65,42.25 29.65,39.25 v29.65,31.15
CON1_HEATER_0
  Top 0.4: IC14.5 65.55,17.45 65.08,16.98 R39.2
  Top 1: 64,16.3 R39.2
  Top 1.8: X3.1 64,16.3
CON1_HEATER_0_CUR  (via drill 0.3)
  Top 0.2: C30.1 67.2,13.2 67.6,12.8 v69.2,12.8
  Top 0.4: C30.1 R42.2
  Bottom 0.2: v69.2,12.8 71.6,15.2 71.6,17.2 72.58,18.18 72.58,29.19 70.17,31.6 52.65,31.6 48.5,35.75 IC8.5
CON1_HEATER_0_IN
  Top 0.4: R34.2 IC14.4 65.55,19.35 65.08,19.82 R39.1
  Top 0.5: R39.1 64,21.39 | 64,21.39 T15.5 | 64,21.39 64,22.66 | 64,22.66 T15.6 | 64,22.66 64,23.93 | 64,23.93 T15.7 | T15.8 63.59,25.2 64,24.8 64,23.93
  pour Top (isolate 0.305, no thermals): 61.6,25.65 64.8,25.65 64.8,19.1 61.6,19.1
CON1_HEATER_0_VOL  (via drill 0.3)
  Top 0.2: C27.1 69.35,24.55 69.6,24.8 v71.2,24.8
  Top 0.4: R34.1 R35.2 C27.1
  Bottom 0.2: v71.2,24.8 71.2,30 70,31.2 52.48,31.2 48,35.68 IC8.6
CON1_HEATER_1
  Bottom 0.4: R51.2 60.42,16.98 59.95,17.45 IC17.5
  Bottom 1: 61.5,16.15 R51.2
  Bottom 1.8: X3.2 61.5,16.15
CON1_HEATER_1_CUR
  Bottom 0.2: C36.1 57.45,13 55.79,13 54.8,13.99 54.8,17 51.58,20.22 51.58,30.97 46,36.55 IC8.10
  Bottom 0.4: C36.1 R54.2
CON1_HEATER_1_IN
  Bottom 0.4: R51.1 60.42,19.82 59.95,19.35 IC17.4 R46.2
  Bottom 0.5: R51.1 61.5,21.39 | 61.5,21.39 T17.5 | 61.5,21.39 61.5,22.66 | 61.5,22.66 T17.6 | 61.5,22.66 61.5,23.93 | 61.5,23.93 T17.7 | T17.8 61.85,25.2 61.5,24.85 61.5,23.93
  pour Bottom (isolate 0.305, no thermals): 63.9,25.65 63.9,19.1 60.7,19.1 60.7,25.65
CON1_HEATER_1_VOL
  Bottom 0.2: C33.1 56.15,23.85 55.45,24.55 53.3,24.55 52,25.85 52,31.12 46.5,36.62 IC8.9
  Bottom 0.4: R46.1 R47.2 C33.1
CON1_SCL  (via drill 0.3)
  Top 0.2: v53.7,13.55 R57.1 55.4,11.47 X3.4 | v45.2,34.53 45.85,35.18 45.85,41.45 47.2,42.8 v47.2,43.2
  Bottom 0.2: v53.7,13.55 50.7,13.55 50.38,13.87 X13.2 50.38,29.69 45.54,34.53 v45.2,34.53 | IC8.26 45.42,46.75 47.2,44.97 v47.2,43.2
CON1_SDA  (via drill 0.3)
  Top 0.2: R56.1 X13.1 52.92,11.45 X3.5 | v45.2,36 45.2,41.69 46.16,42.64 v46.16,43.04
  Bottom 0.2: X13.1 52.92,17.75 50.78,19.89 50.78,29.86 45.2,35.44 v45.2,36 | v46.16,43.04 46.16,45.44 45.35,46.25 IC8.25
CON2_HEATER_0
  Top 0.4: IC15.5 88.5,17.45 88.03,16.98 R40.2
  Top 1: 87,16.4 R40.2
  Top 1.8: X4.1 87,16.4
CON2_HEATER_0_CUR  (via drill 0.3)
  Top 0.2: C31.1 90.2,13 90.4,12.8 v92.2,12.8
  Top 0.4: R43.2 C31.1
  Bottom 0.2: v92.2,12.8 95.2,15.8 95.2,30.8 88.8,37.2 60.97,37.2 54.42,43.75 IC8.61
CON2_HEATER_0_IN
  Top 0.4: R36.2 IC15.4 88.5,19.35 88.03,19.82 R40.1
  Top 0.5: R40.1 87,21.39 | 87,21.39 T9.5 | 87,21.39 87,22.66 | 87,22.66 T9.6 | 87,22.66 87,23.93 | 87,23.93 T9.7 | T9.8 86.69,25.2 87,24.9 87,23.93
  pour Top (isolate 0.305, no thermals): 84.6,25.65 87.8,25.65 87.8,19.1 84.6,19.1
CON2_HEATER_0_VOL  (via drill 0.3)
  Top 0.2: 92.2,23.2 C28.1 92.35,23.95 92.8,24.4 v94.4,24.4
  Top 0.4: C28.1 R37.2 R36.1
  Bottom 0.2: v94.4,24.4 94.4,31.03 88.63,36.8 60.8,36.8 54.8,42.8 54.35,43.25 IC8.62
CON2_HEATER_1
  Bottom 0.4: IC18.5 82.95,17.45 83.42,16.98 R52.2
  Bottom 1: 84.5,16.45 R52.2
  Bottom 1.8: X4.2 84.5,16.45
CON2_HEATER_1_CUR
  Bottom 0.2: C37.1 80.5,13.05 78.74,13.05 77.8,13.99 77.8,16.93 75.6,19.13 75.6,32.8 72.4,36 60.4,36 54.15,42.25 IC8.64
  Bottom 0.4: C37.1 R55.2
CON2_HEATER_1_IN
  Bottom 0.4: R48.2 IC18.4 82.95,19.35 83.42,19.82 R52.1
  Bottom 0.5: R52.1 84.5,21.39 | 84.5,21.39 T13.5 | 84.5,21.39 84.5,22.66 | 84.5,22.66 T13.6 | 84.5,22.66 84.5,23.93 | 84.5,23.93 T13.7 | T13.8 84.81,25.2 84.5,24.9 84.5,23.93
  pour Bottom (isolate 0.305, no thermals): 86.9,25.65 86.9,19.1 83.7,19.1 83.7,25.65
CON2_HEATER_1_VOL
  Bottom 0.2: C34.1 79.15,34.05 76.8,36.4 60.57,36.4 54.22,42.75 IC8.63
  Bottom 0.4: R48.1 R49.2 C34.1
CON2_SCL  (via drill 0.3)
  Top 0.2: v76.65,13.5 R59.1 78.4,11.47 X4.4 | v53.23,33.23 53.23,34.77 50.53,37.47 50.53,42.97 v50.32,43.18
  Bottom 0.2: v76.65,13.5 73.75,13.5 73.38,13.87 X15.2 73.38,29.52 70.5,32.4 54.05,32.4 v53.23,33.23 | v50.32,43.18 51.4,44.25 IC8.60
CON2_SDA  (via drill 0.3)
  Top 0.2: X4.5 75.92,11.45 X15.1 R58.1 | v54.47,33.07 54.47,34.09 50.93,37.64 50.93,43.47 v50.35,44.05
  Bottom 0.2: X15.1 75.92,17.68 73.78,19.82 73.78,29.68 70.66,32.8 54.75,32.8 v54.47,33.07 | v50.35,44.05 51.05,44.75 IC8.59
DIODE_G
  Bottom 0.4: T1.4 25.26,26.06 24.8,25.6 24.8,22.85 25.23,22.43 IC1.4
GND  (via drill 0.3, 0.35, 0.5, 0.6)
  Top 0.2: C11.2 v53.75,46.5 | C17.2 v43,44.5 | v50.25,50.15 C16.2 | v43.25,50.2 C18.2 | v28.65,36.8 29.85,38 v37.2,38 v41.35,38 | v41.2,62.63 41.63,62.63 41.88,62.88 IC10.10 | X6.1 v56.3,36.05
  Top 0.4: T6.2 R5.1 38.5,13.77 v36.73,12 | T14.2 R13.1 61.5,13.7 v59.8,12 | T7.2 R6.1 84.5,13.5 v83,12 | v88.5,10.35 88.5,5.65 88.03,5.65 | v66,10 66,5.66 64.4,5.66 | v42.8,10 42.8,5.66 | C15.2 C11.2 C12.2 | v56.3,36.05 57.65,36.05 v60.8,39.2 | v96.4,49.2 96.4,51.73 IC7.4 92.3,55.12 v87,55.12 | T5.2 96.4,45.37 v96.4,44.4 | T5.3 96.4,46.63 v96.4,45.6 | T5.1 96.4,44.09 v96.4,43.2 | IC5.4 95.2,39.73 v95.2,39.6 | T3.3 96.4,34.63 v96.4,34.8 | T3.2 96.4,33.37 v96.4,33.6 | T3.1 96.4,32.09 96.4,32.4
  Top 0.5: X11.6 81,63.25 80.25,64 73.75,64 73,63.25 X11.2 | v31.6,48.4 v32.99,49.79 | v33.83,49.03 v32.4,47.6
  Top 0.6: X6.1 X6.3 | v7.15,27.95 5.25,27.95 | X8.2 4.5,49.9 2.8,51.6 2.8,58.8 7.2,63.2 31.2,63.2 X7.8 | X10.8 15.6,63.2 16,63.2 | v28.8,2 v28.8,3.2 28.8,5.66 28.5,5.66 | v30,2 v30,3.2 30,5.66 29.6,5.66 | v31.2,2 v31.2,3.2 31.2,5.66 30.8,5.66 | v32.4,2 v32.4,3.2 32.4,5.66 33.6,5.66 v33.6,3.2 v33.6,2 | v34.8,2 v34.8,3.2 34.8,5.66 | v36,2 v36,3.2 36,5.66 36.4,5.66 | v37.2,2 v37.2,3.2 37.2,5.66 37.6,5.66 | v38.4,2 v38.4,3.2 38.4,5.66 38.8,5.66 | 55.6,5.66 56,5.66 | v52,2 v52,3.2 52,5.66 51.5,5.66 | v53.2,2 v53.2,3.2 53.2,5.66 | v54.4,2 v54.4,3.2 54.4,5.66 55.6,5.66 | v55.6,2 v55.6,3.2 55.6,5.66 | v56.8,2 v56.8,3.2 56.8,5.66 57.2,5.66 58,5.66 v58,3.2 v58,2 | v59.2,2 v59.2,3.2 59.2,5.66 | v60.4,2 v60.4,3.2 60.4,5.66 | v61.6,2 v61.6,3.2 61.6,5.66 | v74.8,2 v74.8,3.2 74.8,5.66 74.55,5.66 | v76,2 v76,3.2 76,5.66 76.4,5.66 | v77.2,2 v77.2,3.2 77.2,5.66 77.6,5.66 | v78.4,2 v78.4,3.2 78.4,5.66 78.8,5.66 | v79.6,2 v79.6,3.2 79.6,5.66 | v80.8,2 v80.8,3.2 80.8,5.66 | v82,2 v82,3.2 82,5.66 | v83.2,2 v83.2,3.2 83.2,5.66 | v84.4,2 v84.4,3.2 84.4,5.66 | v95.2,33.6 v96.4,33.6 v97.6,33.6 | v95.2,34.8 v96.4,34.8 v97.6,34.8 | v95.2,36 v96.4,36 v97.6,36 | v95.2,37.2 v96.4,37.2 v97.6,37.2 | v95.2,38.4 v96.4,38.4 v97.6,38.4 | v95.2,39.6 v96.4,39.6 v97.6,39.6 | v95.2,40.8 v96.4,40.8 v97.6,40.8 | v95.2,42 v96.4,42 v97.6,42 | v95.2,43.2 v96.4,43.2 v97.6,43.2 | v95.2,44.4 v96.4,44.4 v97.6,44.4 | v95.2,45.6 v96.4,45.6 v97.6,45.6 | v95.2,46.8 v96.4,46.8 v97.6,46.8 | v95.2,48 v96.4,48 v97.6,48 | v97.6,49.2 v96.4,49.2 v95.2,49.2
  Top 0.8: 5.2,9.2 v3.2,9.2
  Top 1.5: 5.25,27.95 5.25,27.6
  Top 1.8: X2.7 26,5.66 | X2.6 28.5,5.66 | X3.7 49,5.66 | X3.6 51.5,5.66 | X4.7 72,5.66 | 74.55,5.66 74.5,5.66 X4.6
  Top 2.2: 5.2,16.75 5.2,9.2 5.2,8 7.54,5.66 26,5.66 28.5,5.66 29.6,5.66 30.8,5.66 32.4,5.66 34.8,5.66 36.4,5.66 37.6,5.66 38.8,5.66 42.8,5.66 49,5.66 51.5,5.66 53.2,5.66 55.6,5.66 57.2,5.66 59.2,5.66 60.4,5.66 61.6,5.66 64.4,5.66 72,5.66 74.55,5.66 76.4,5.66 77.6,5.66 78.8,5.66 79.6,5.66 80.8,5.66 82,5.66 83.2,5.66 84.4,5.66 88.02,5.66 88.03,5.65 93.25,5.65 96.4,8.8 96.4,32.4 v96.4,33.6 v96.4,34.8 v96.4,36 v96.4,37.2 v96.4,38.4 v96.4,39.6 v96.4,40.8 v96.4,42 v96.4,43.2 v96.4,44.4 v96.4,45.6 v96.4,46.8 v96.4,48 v96.4,49.2
  Top 2.3: 5.2,16.75 C4.- 5.25,27.6 C2.- 5.25,41.25 7.35,43.35 X8.2
  Bottom 0.2: 38.45,38 IC12.2 | C24.2 39.55,31 40.1,31.55 IC11.2 40.1,32.85 40.35,33.1 41.1,33.1 41.1,33.12 41.35,33.37 v41.35,38 | v53.75,46.5 53.75,46.95 53.45,47.25 IC8.54 51.55,47.25 50.8,48 50.25,48 | v43,44.5 42.75,44.75 IC8.22 32.4,44.75 | IC8.47 50,50.4 v50.25,50.15 50.25,48 | JP1.1 28.65,34.8 v28.65,36.8 28.65,41.85 31.55,44.75 32.4,44.75 | 32.4,63.95 X7.8 | R21.1 32.4,63.95 | 32.4,63.95 38.12,63.95 39.45,62.63 v41.2,62.63 | v56.3,36.05 C21.2 | X9.2 88.65,62.4 | 88.65,62.4 88.65,60.25 86.17,57.77 IC9.4 v87,55.12 | X11.6 88.65,62.4 | 50.25,48 45.45,48 v43.25,50.2 43,50.45 IC8.33 43,52.5 42.7,52.8 35.2,52.8 34.8,52.4 34.8,50.4 | C20.2 34.8,50.4 | v31.6,48.4 v32.4,47.6 32.4,44.75 | v32.99,49.79 32.99,50.14 33.25,50.4 34.8,50.4
  Bottom 0.4: T11.2 R10.1 87.4,13 88.5,11.9 v88.5,10.35 | T16.2 R15.1 64.4,12.8 66,11.2 v66,10 | C25.2 37.6,39.55 37.2,39.15 v37.2,38 | v37.2,38 37.2,36.55 37.6,36.15 R26.1 | IC12.2 37.25,37.95 v37.2,38 | X4.6 74.5,11.5 75,12 v83,12 | X3.6 51.5,11.5 52,12 v59.8,12 | X2.6 28.5,11.5 29,12 v36.73,12 | IC1.5 23.18,22.43 24.4,21.2 R17.1 | R9.1 41.4,12.6 42.8,11.2 v42.8,10 | C20.2 C19.2 | 16.8,44.2 9.4,44.2 7.35,46.25 X8.2 | 16.8,44.2 16.8,41.2 17.6,40.4 C39.2 | C38.2 22,43.6 21.4,44.2 20,44.2 | 16.8,44.2 20,44.2 | IC19.2 20,44.2
  Bottom 0.5: C23.2 C21.2 | 8,8.05 C3.2 | 8,8.05 R3.1 C6.2 | 8,8.05 12.65,8.05 13.05,7.65 IC3.2 | X11.2 73,59 70.35,56.35 63.34,56.35 61.8,57.89 61.8,60 | 61.8,60 X5.2 | X5.3 60.8,60.4 61.2,60 61.8,60
  Bottom 0.6: T10.2 R9.1 | v9.15,27.95 10.24,27.95 IC2.1 10.26,31.46 11.6,32.8 JP1.1 | v9.15,27.95 v9.15,28.95 v8.15,28.95 | v8.15,27.95 v9.15,27.95 | v8.15,27.95 v7.15,27.95 | v7.15,27.95 v7.15,28.95 v8.15,28.95 | v8.15,28.95 v8.15,27.95 | v7.15,27.95 v7.15,26.95 v8.15,26.95 | v8.15,26.95 v8.15,27.95 | v9.15,27.95 v9.15,26.95 v8.15,26.95 | v50.25,50.15 50.95,50.15 52,51.2 54.4,51.2 58.8,46.8 v95.2,46.8
  Bottom 0.8: v3.2,9.2 3.2,8 4.45,6.75 R3.1
  Bottom 1: X2.7 26,12.3 25.5,12.8 R17.1
  pour Top: 5.3,29.6 10,29.6 10,26.3 5.3,26.3
  pour Bottom (isolate 0.305, no thermals): 5.6,30.4 5.6,25.6 10.8,25.6 10.8,30.4
  pour Top (isolate 0.305, rank 3, no thermals): 0,52 9.8,52 9.8,12.8 93.6,12.8 93.6,31.6 92,31.6 92,55.23 100,55.23 100,0 0,0
  pour Bottom (isolate 0.4, rank 3): 0,0 100,0 100,66.4 0,66.4
HEATER0_AD_OUT0
  Top 0.4: R41.1 IC13.1
HEATER0_AD_OUT1
  Bottom 0.4: R53.1 IC16.1
HEATER0_G0
  Top 0.4: T6.3 R7.1 T8.4
HEATER0_G1
  Bottom 0.6: T10.3 R11.1 T12.4
HEATER1_AD_OUT0
  Top 0.4: R42.1 IC14.1
HEATER1_AD_OUT1
  Bottom 0.4: R54.1 IC17.1
HEATER1_G0
  Top 0.4: T14.3 R14.1 T15.4
HEATER1_G1
  Bottom 0.4: T17.4 R16.1 T16.3
HEATER2_AD_OUT0
  Top 0.4: R43.1 IC15.1
HEATER2_AD_OUT1
  Bottom 0.4: R55.1 IC18.1
HEATER2_G0
  Top 0.4: T9.4 R8.1 T7.3
HEATER2_G1
  Bottom 0.4: T11.3 R12.1 T13.4
HEATER_CTRL_0  (via drill 0.3)
  Top 0.2: R5.2 v36.6,14 | v32,26 32,31.39 33.26,32.65 34.55,32.65 34.7,32.8 46.31,32.8 48,34.49 48,48.06 48.78,48.84 v48.78,49.18
  Top 0.4: R5.2 T6.1
  Bottom 0.2: v36.6,14 36.6,13.6 35.6,12.6 35.2,12.6 32.63,12.6 31.4,13.83 31.4,15.6 31.4,17.6 30.1,18.9 | 30.1,18.9 30.05,18.95 | 30.1,18.9 30.05,18.95 | v32,26 30.05,24.05 30.05,18.95 | v48.78,49.18 49,49.4 IC8.45
HEATER_CTRL_1  (via drill 0.3)
  Top 0.2: v44.4,11.6 v46.4,11.6 | v49.6,49.39 49.6,49.1 48.4,47.9 48.4,33.38 v47.12,32.1
  Bottom 0.2: R9.2 43.3,12.7 v44.4,11.6 | v46.4,11.6 48,13.2 48,15.9 49.98,17.88 49.98,29.24 v47.12,32.1 | v49.6,49.39 49.5,49.49 IC8.46
  Bottom 0.6: R9.2 T10.1
HEATER_CTRL_2  (via drill 0.3)
  Top 0.2: R13.2 v59.6,13.85 | v54.25,50.1 53.45,49.3 50.37,49.3 48.8,47.73 48.8,32.9 v49.11,32.59
  Top 0.4: R13.2 T14.1
  Bottom 0.2: v59.6,13.85 59.6,13.45 58.75,12.6 55.63,12.6 54.4,13.83 54.4,16.83 51.18,20.05 51.18,30.52 v49.11,32.59 | v54.25,50.1 54,49.85 53.9,49.75 IC8.49
HEATER_CTRL_3  (via drill 0.3)
  Top 0.2: v66.8,11.6 v69.2,11.6 | v50.4,34.8 49.2,36 49.2,47.57 50.53,48.9 54.2,48.9 v54.7,49.4
  Bottom 0.2: R15.2 66.3,12.1 v66.8,11.6 | v69.2,11.6 72,14.4 72,17.03 72.98,18.01 72.98,29.35 70.33,32 53.2,32 v50.4,34.8 | v54.7,49.4 54.55,49.25 IC8.50
  Bottom 0.4: R15.2 T16.1
HEATER_CTRL_4  (via drill 0.3)
  Top 0.2: R6.2 v82.6,14 | v55.2,48.75 54.95,48.5 50.7,48.5 49.6,47.4 49.6,36.45 v52.03,34.03
  Top 0.4: R6.2 T7.1
  Bottom 0.2: v82.6,14 82.6,13.2 82.05,12.65 78.58,12.65 77.4,13.83 77.4,16.77 74.18,19.99 74.18,29.85 70.83,33.2 55.2,33.2 54.37,34.03 v52.03,34.03 | v55.2,48.75 IC8.51
HEATER_CTRL_5  (via drill 0.3)
  Top 0.2: v89.6,11.6 v92.2,11.6
  Bottom 0.2: R10.2 89.3,11.9 v89.6,11.6 | v92.2,11.6 95.6,15 95.6,30.97 88.97,37.6 61.2,37.6 56,42.8 54.8,44 54.8,45.2 54.8,46.8 53.85,47.75 IC8.53
  Bottom 0.4: R10.2 T11.1
LDO_IN  (via drill 0.5)
  Top 0.4: v17.05,27.96 v17.05,28.86 v17.95,28.86 | v17.95,27.96 v17.95,27.02 | v17.95,27.02 v18.85,27.02 v18.85,27.96 | v17.05,27.96 v17.05,27.02 v17.95,27.02 | v17.05,27.96 v17.95,27.96 | v17.95,28.86 v18.85,28.86 v18.85,27.96 | v17.95,28.86 17.95,28 v17.95,27.96 | v17.95,27.96 v18.85,27.96
  Top 1.5: C2.+ 18.75,32.35 17.95,31.55 17.95,28
  Bottom 0.4: IC2.3 v17.05,27.96 | IC1.8 20.4,24.38 | 20.4,24.38 20.4,26.06 | IC1.7 20.68,23.73 20.4,24 20.4,24.38
  Bottom 0.6: v18.85,28.86 18.8,28.86 | 18.8,28.86 v17.95,28.86 | T1.7 20,28.6 20,28 | T1.6 20,27.33 20,28 | T1.5 20.4,26.06 19.8,26.06 v18.85,27.02 | T1.8 19.82,29.87 18.82,28.86 18.8,28.86 | v18.85,27.96 20,27.96 20,28
  pour Bottom (isolate 0.305, no thermals): 22.8,30.4 14.8,30.4 14.8,25.6 22.8,25.6
  pour Top (isolate 0.305): 12,38.8 24.4,38.8 24.4,25.6 12,25.6
LED_BLUE_D
  Bottom 0.8: R23.1 77,57 T19.3
LED_BLUE_PWM  (via drill 0.35)
  Top 0.2: v83.2,57.37 78.97,57.37 78.4,56.8 v78.4,55.6
  Bottom 0.2: v78.4,55.6 77.95,55.15 T19.1 | IC9.2 84.88,56.73 84.23,57.37 v83.2,57.37
  Bottom 0.8: R22.1 T19.1
LED_GREEN_D
  Bottom 0.8: R31.1 75,58.2 75,56.6 74.4,56 T21.3
LED_GREEN_PWM  (via drill 0.35)
  Top 0.2: v82.4,58 76,58 74.9,56.9 v74.9,53.8
  Bottom 0.2: IC9.3 85.53,56.88 84.4,58 v82.4,58 | v74.9,53.8 T21.1
  Bottom 0.8: R30.1 T21.1
LED_RED_D
  Bottom 0.8: R29.1 79,57 79,56.6 79.6,56 T20.3
LED_RED_PWM
  Bottom 0.2: T20.1 84,53.8 84.22,54.02 IC9.1
  Bottom 0.8: R24.1 T20.1
RECT_D1_CAP_H1
  Top 0.3: 69.25,38.5 IC4.7 68.34,38.42 68.1,38.66 68.1,41.16 68.44,41.5 C7.1
RECT_D1_CAP_L1
  Top 0.3: C7.2 71.16,39.21 72.59,37.77 IC4.1
RECT_D1_G1
  Top 0.3: IC4.6 70.58,39.08 72.86,36.8 74,36.8 | IC4.2 74.63,38.42 74.91,38.15 74.91,38.1 74.91,37.9 74.91,37.1 74.61,36.8 74,36.8 | 74.2,35.92 T2.4 74.18,36.8 74,36.8
RECT_D2_CAP_H1
  Top 0.3: C9.2 71.16,51.3 72.68,49.77 IC6.1
RECT_D2_CAP_L1
  Top 0.3: IC6.7 68.33,50.42 68.1,50.65 68.1,53.25 68.35,53.5 C9.1
RECT_D2_G1
  Top 0.3: IC6.6 70.67,51.08 72.95,48.8 74.18,48.8 | IC6.2 74.63,50.42 74.91,50.15 74.91,49.1 74.61,48.8 74.2,48.8 74.18,48.8 | T4.4 74.18,48.8
RECT_D3_CAP_H1
  Top 0.3: C8.1 87,41.5 86.7,41.2 86.7,38.6 86.88,38.42 IC5.7
RECT_D3_CAP_L1
  Top 0.3: C8.2 89.8,39.21 91.23,37.77 IC5.1
RECT_D3_G1
  Top 0.3: IC5.6 89.22,39.08 91.5,36.8 92.83,36.8 | IC5.2 93.28,38.42 93.55,38.15 93.55,37.1 93.25,36.8 92.85,36.8 92.83,36.8 | T3.4 92.83,36.8
RECT_D4_CAP_H1
  Top 0.3: C10.2 89.8,51.21 91.23,49.77 IC7.1
RECT_D4_CAP_L1
  Top 0.3: IC7.7 86.92,50.42 86.7,50.65 86.7,53.3 87,53.6 C10.1
RECT_D4_G1
  Top 0.3: IC7.6 89.22,51.08 91.5,48.8 92.9,48.8 | IC7.2 93.28,50.42 93.55,50.15 93.55,49.1 93.25,48.8 92.9,48.8 | T5.4 92.83,48.73 92.9,48.8
RESET_SW_IN
  Top 0.6: X6.4 58,40.7 57.6,40.7 X6.2 56.3,37.9 55.2,36.8 R20.1
RESETN  (via drill 0.3)
  Top 0.2: IC10.13 43.17,56.7 43.87,56 58.8,56 | X5.10 58.8,56 | v55.6,46.8 57.6,46.8 58.8,48 58.8,56 | R19.1 57.1,42.3 v57.23,42.43
  Top 0.6: R19.1 C22.2 R20.2
  Bottom 0.2: IC8.52 54.15,48.25 v55.6,46.8 55.6,44.05 v57.23,42.43
RPI_HARDRST_1
  Bottom 0.2: T18.3 26.7,60 X7.9
RPI_HARDRST_2
  Bottom 0.2: T18.2 X7.10
RPI_INT
  Top 0.2: IC10.12 42.52,59.73 42.25,60 40.57,60 39.22,58.65 35.75,58.65 X7.5
RPI_INT_HI  (via drill 0.3)
  Top 0.2: v42.52,57 42.52,56.78 43.71,55.6 47.4,55.6 v47.85,55.15 | v42.52,62.6 IC10.9
  Bottom 0.2: v42.52,57 v42.52,62.6 | IC8.41 47,53.73 47.85,54.58 v47.85,55.15
RPI_RESET  (via drill 0.3)
  Top 0.2: v40.8,56.63 41.77,56.63 45.2,53.2 45.2,48 v46.55,46.65
  Bottom 0.2: T18.1 25.75,58.65 27.77,56.63 v40.8,56.63 | IC8.4 49,43.73 46.55,46.18 v46.55,46.65
  Bottom 0.4: T18.1 R21.2
RPI_RXD
  Top 0.2: X7.2 39.2,61.2 45.77,61.2 | 45.77,61.2 IC10.4 | 45.77,61.2 49.13,61.2 X17.1
RPI_RXD_HI  (via drill 0.3)
  Top 0.2: IC10.17 v45.77,59.9 | v46.6,50.4 47,50.8 v47,54.7
  Bottom 0.2: IC8.36 44.5,50.9 45,50.4 v46.6,50.4 | 45.77,56.73 45.77,56.8 | 45.77,56.8 v45.77,59.9 46.67,60.8 53.38,60.8 X14.1 | v47,54.7 45.77,55.92 45.77,56.8
RPI_SWCLK
  Top 0.2: IC10.14 43.83,60.17 43.6,60.4 40.4,60.4 39.05,59.05 37.35,59.05 X7.3
RPI_SWDIO
  Top 0.2: IC10.6 44.48,62.33 43.75,61.6 40.4,61.6 39.1,62.9 37.3,62.9 X7.4
RPI_SWRST
  Top 0.2: IC10.8 43.17,62.23 42.95,62 40.57,62 39.27,63.3 35.7,63.3 X7.6
RPI_TXD
  Top 0.2: X7.1 39.2,60.8 45.12,60.8 | 45.12,60.8 IC10.16 | 45.12,60.8 49.13,60.8 X17.2
RPI_TXD_HI  (via drill 0.3)
  Top 0.2: IC10.5 45.12,62.09 v44.87,61.83 | v45.9,49.8 45.9,52 v45.9,54.7
  Bottom 0.2: 44.87,61.2 v44.87,61.83 | IC8.35 44,50.51 44.66,49.86 | 44.66,49.86 44.69,49.82 | 44.66,49.86 44.72,49.8 v45.9,49.8 | v45.9,54.7 44.87,55.73 44.87,61.2 | X14.2 53.38,61.2 44.87,61.2
SWCLK  (via drill 0.3)
  Top 0.2: X5.9 v59.8,57.8 59.8,46.6 58.52,45.33 v54.12,45.33 | IC10.7 v43.83,62.7 | v43.83,56.9 44.33,56.4 57.6,56.4 v58,56.8
  Bottom 0.2: IC8.57 53.7,45.75 v54.12,45.33 | v43.83,62.7 v43.83,56.9 | v58,56.8 59,57.8 v59.8,57.8
SWDIO  (via drill 0.3)
  Top 0.2: v54.2,44.4 57.2,44.4 59.37,44.4 60.8,45.83 60.8,56.8 v60.8,58.8 62.4,58.8 62.8,59.2 X5.6 | IC10.15 44.48,57.27 44.95,56.8 56.8,56.8 57.6,57.6 v57.6,58.8
  Bottom 0.2: IC8.58 53.35,45.25 v54.2,44.4 | v57.6,58.8 v60.8,58.8
UI_BUTTON  (via drill 0.3)
  Top 0.2: v61.6,54.8 65.6,54.8 71,60.2 X11.1
  Bottom 0.2: IC8.42 47.5,53.67 48.63,54.8 v61.6,54.8
  Bottom 0.8: R18.1 X11.1
UI_LED_BLUE
  Bottom 0.8: X11.4 R23.2
UI_LED_GREEN
  Bottom 0.8: R31.2 X11.3
UI_LED_RED
  Bottom 0.8: R29.2 X11.5
UI_ROT1_A
  Bottom 0.2: IC8.24 35.85,45.75 32.4,49.2 27.2,54.4 15.8,54.4 10.6,59.6 10.6,61 X10.14
UI_ROT1_B  (via drill 0.3)
  Top 0.2: v43.01,48.05 37.71,48.05 28.97,56.8 17.4,56.8 14.6,59.6 14.6,61 X10.10
  Bottom 0.2: IC8.28 42.7,47.75 v43.01,48.05
UI_ROT1_SW  (via drill 0.3)
  Top 0.2: v45.17,45.57 44.43,45.57 43.05,46.95 37.68,46.95 28.63,56 16.2,56 12.6,59.6 12.6,61 X10.12
  Bottom 0.2: IC8.11 45.5,45.25 v45.17,45.57
UI_ROT2_A  (via drill 0.3)
  Top 0.2: v43.6,47.35 42.8,47.35 37.85,47.35 28.8,56.4 16.8,56.4 13.6,59.6 X10.9
  Bottom 0.2: IC8.27 43.5,47.25 v43.6,47.35
UI_ROT2_B
  Bottom 0.2: 41,45.3 IC8.23 35.78,45.25 27.03,54 15.2,54 9.6,59.6 X10.13
UI_ROT2_SW  (via drill 0.3)
  Top 0.2: v44.69,44.51 42.65,46.55 37.52,46.55 28.47,55.6 15.6,55.6 11.6,59.6 X10.11
  Bottom 0.2: IC8.12 45,44.2 v44.69,44.51
UI_ROT3_A
  Bottom 0.2: IC8.40 46.5,53.2 43.7,56 25.6,56 X10.1
UI_ROT3_B  (via drill 0.3)
  Top 0.2: v43.4,48.8 37.53,48.8 29.13,57.2 20,57.2 17.6,59.6 X10.5
  Bottom 0.2: IC8.29 42.35,48.25 42.9,48.8 v43.4,48.8
UI_ROT3_SW
  Bottom 0.2: IC8.38 45.5,53.07 43.37,55.2 24,55.2 19.6,59.6 X10.3
UI_ROT4_A  (via drill 0.3)
  Top 0.2: v42.7,49.45 37.45,49.45 29.3,57.6 20.6,57.6 18.6,59.6 18.6,61 X10.6
  Bottom 0.2: IC8.30 42,48.75 v42.7,49.45
UI_ROT4_B
  Bottom 0.2: IC8.39 45.95,51.75 45.95,53.18 43.53,55.6 24.65,55.6 20.6,59.65 20.6,61 X10.2
UI_ROT4_SW
  Bottom 0.2: IC8.37 45,53 43.2,54.8 23.4,54.8 19.3,58.9 18.6,59.6 18.6,61 X10.4
UI_SCL  (via drill 0.3)
  Top 0.2: v38.5,34.5 43.07,34.5 44.4,35.83 44.4,42.14 47.6,45.34 47.6,48.55 v47.92,48.88 | R63.1 92.55,57.6 92.92,57.97 X16.2 92.92,61.98 92.65,62.25 X9.4
  Bottom 0.2: IC11.3 39.45,32.75 38.5,33.7 v38.5,34.5 | X16.2 92.92,57.72 90.78,55.58 90.78,52.61 89.77,51.6 86.17,51.6 85.53,50.96 IC9.6 85.53,48.56 84.57,47.6 59.43,47.6 53.03,54 49,54 48.5,53.5 IC8.44 48.5,49.95 47.92,49.37 v47.92,48.88
UI_SDA  (via drill 0.3)
  Top 0.2: v39.05,35.2 39.34,34.9 42.9,34.9 44,36 44,42.3 47.2,45.51 47.2,49.54 v47.83,50.17 | R62.1 X16.1 90.38,61.98 90.65,62.25 X9.3
  Bottom 0.2: IC11.4 39.45,34.4 39.05,34.8 v39.05,35.2 | X16.1 90.38,52.78 89.6,52 86,52 84.88,50.88 IC9.7 84.88,48.48 84.4,48 59.6,48 53.2,54.4 48.8,54.4 48,53.6 IC8.43 48,50.34 v47.83,50.17
VDDANA  (via drill 0.3)
  Top 0.2: C13.1 v47.25,41.9
  Top 0.3: C13.1 46.65,40.95 46.4,40.7 46.4,34.77 45.48,33.85 39.6,33.85 34.75,33.85 34.6,34 33.12,34 30.55,31.43 30.55,23.35 29.35,22.15 C14.1
  Top 0.6: C14.1 L2.2
  Bottom 0.2: IC8.8 47,41.65 v47.25,41.9
VDDCORE  (via drill 0.3)
  Top 0.2: v50.4,46.4 50.5,46.5 C11.1
  Top 0.4: C11.1 C12.1
  Bottom 0.2: IC8.55 51.6,46.75 | 51.6,46.75 51.5,46.75 | 51.6,46.75 50.75,46.75 v50.4,46.4
XIN
  Bottom 0.2: IC8.31 38.9,49.25 38.4,48.75 Q1.1 37,47.55 36.75,47.3 C19.1
XIN32
  Bottom 0.2: Q2.1 50.5,39.35 IC8.1
  Bottom 0.5: Q2.1 C21.1
XOUT
  Bottom 0.2: IC8.32 38.9,49.75 38.4,50.25 Q1.2 36.95,51.45 36.7,51.7 C20.1
XOUT32
  Bottom 0.2: Q2.2 50,39.35 IC8.2
  Bottom 0.5: Q2.2 C23.1
ZC_ADJ
  Bottom 0.2: IC11.6 40.75,34.4 40.6,34.55 40.1,34.55 | 40.1,34.55 IC11.5 | 40.1,34.55 R28.1
ZC_IN+
  Bottom 0.25: R28.2 IC12.3
  Bottom 0.4: R27.1 R28.2
ZC_IN+-
  Bottom 0.4: IC12.4 35,37 34.8,36.8 34.8,35.4 | 34.8,35.4 34.8,33.6 35.05,33.35 R25.1 | R26.2 34.8,35.4
ZERO_CROSSING  (via drill 0.3)
  Top 0.2: JP1.5 28.64,42.96 30.8,40.8 v38.85,40.8
  Bottom 0.2: IC12.1 38.5,40.45 v38.85,40.8 39.45,41.4 42.65,41.4 43,41.05 IC8.16

## Text on the board
tNames: RXD | TXD | TXD | RXD | Lo | Hi | SDA | SCL | +3V3 | ZC | +5V | +18V | +12V Pulse | GND | SCL | SDA | SCL | SDA | SCL | SDA